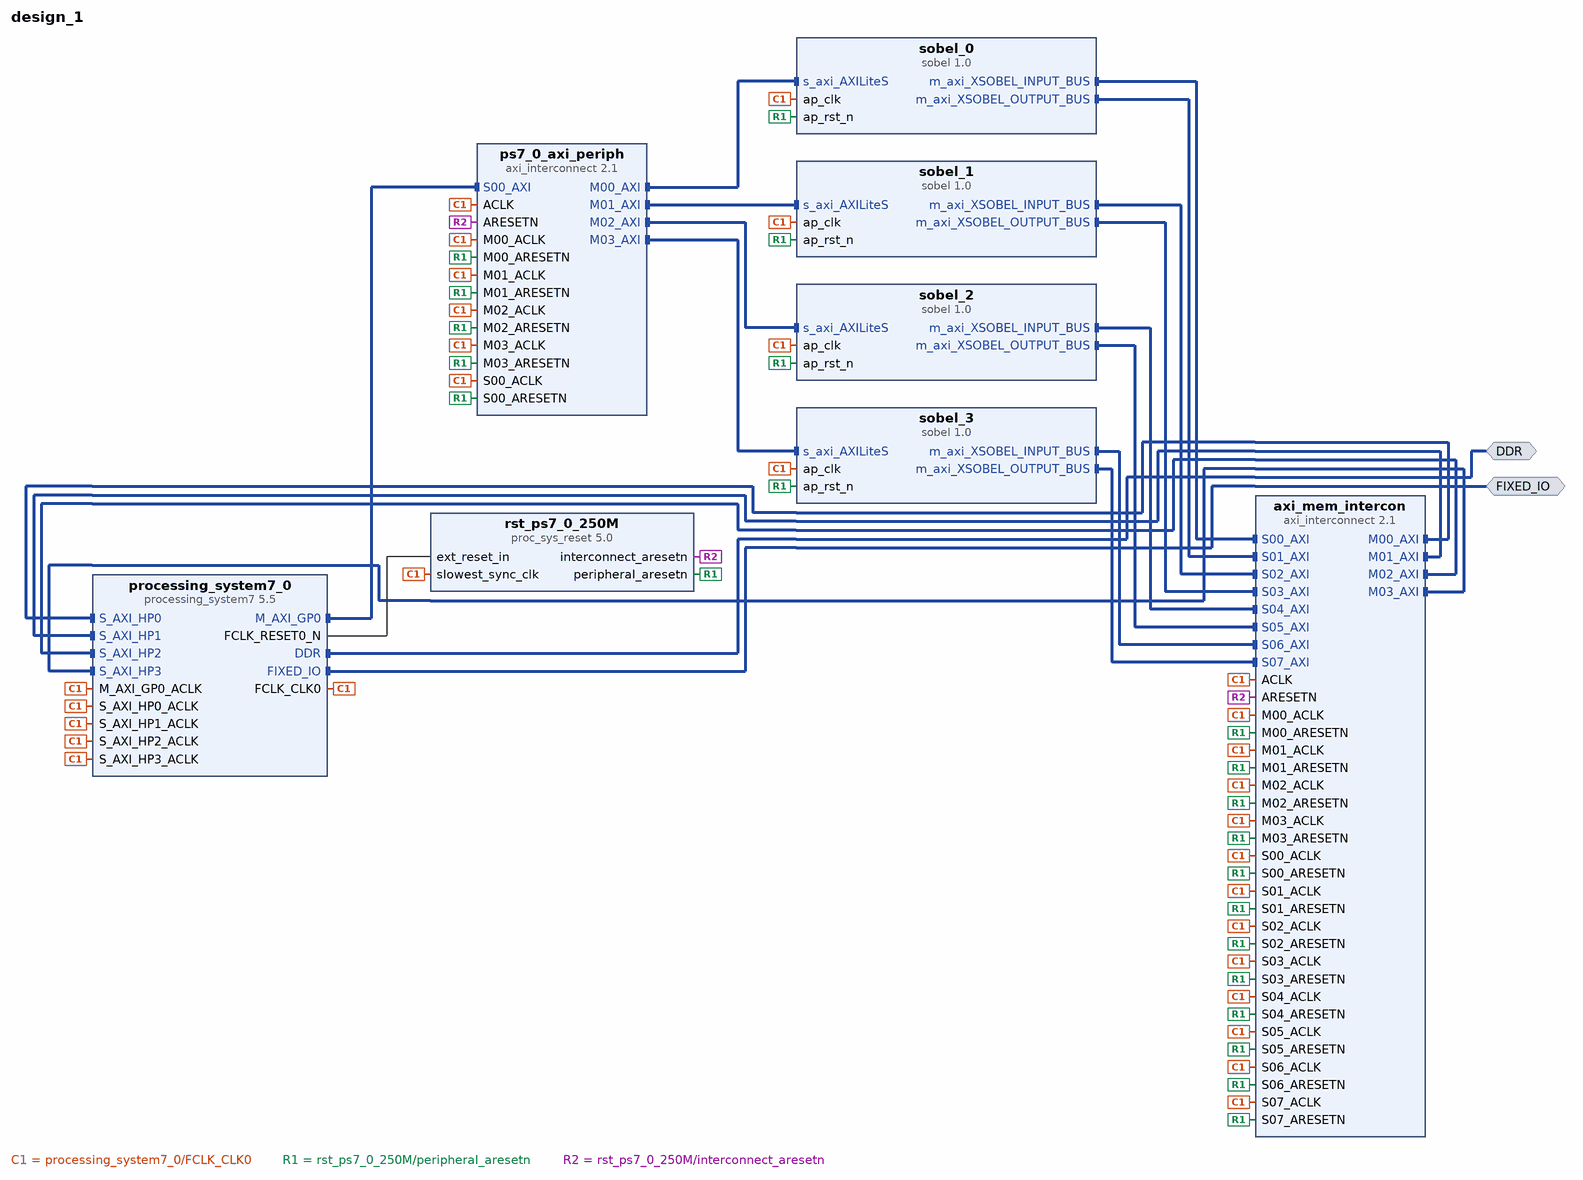
[diagram p0: block diagram of the top level]
# Vivado block design design_1, xc7z020clg484-1, Vivado 2016.4
create_bd_design design_1

create_bd_intf_port -mode Master -vlnv xilinx.com:interface:ddrx_rtl:1.0 DDR
create_bd_intf_port -mode Master -vlnv xilinx.com:display_processing_system7:fixedio_rtl:1.0 FIXED_IO

create_bd_cell -type ip -vlnv xilinx.com:ip:processing_system7:5.5 processing_system7_0
set_property -dict [list \
  CONFIG.PCW_FPGA0_PERIPHERAL_FREQMHZ 227 \
  CONFIG.PCW_USE_S_AXI_HP0 1 \
  CONFIG.PCW_USE_S_AXI_HP1 1 \
  CONFIG.PCW_USE_S_AXI_HP2 1 \
  CONFIG.PCW_USE_S_AXI_HP3 1 \
  CONFIG.PCW_QSPI_GRP_SINGLE_SS_ENABLE 1 \
  CONFIG.PCW_WDT_PERIPHERAL_ENABLE 1 \
  CONFIG.preset ZedBoard \
] [get_bd_cells processing_system7_0]
create_bd_cell -type ip -vlnv xilinx.com:ip:axi_interconnect:2.1 ps7_0_axi_periph
set_property -dict {CONFIG.NUM_MI 4} [get_bd_cells ps7_0_axi_periph]
create_bd_cell -type ip -vlnv xilinx.com:ip:proc_sys_reset:5.0 rst_ps7_0_250M
create_bd_cell -type ip -vlnv xilinx.com:ip:axi_interconnect:2.1 axi_mem_intercon
set_property -dict {CONFIG.NUM_SI 8 CONFIG.NUM_MI 4} [get_bd_cells axi_mem_intercon]
create_bd_cell -type ip -vlnv xilinx.com:hls:sobel:1.0 sobel_0
create_bd_cell -type ip -vlnv xilinx.com:hls:sobel:1.0 sobel_1
create_bd_cell -type ip -vlnv xilinx.com:hls:sobel:1.0 sobel_2
create_bd_cell -type ip -vlnv xilinx.com:hls:sobel:1.0 sobel_3

# ---- connections ----

connect_bd_intf_net [get_bd_intf_pins processing_system7_0/M_AXI_GP0] [get_bd_intf_pins ps7_0_axi_periph/S00_AXI]
connect_bd_intf_net [get_bd_intf_pins ps7_0_axi_periph/M00_AXI] [get_bd_intf_pins sobel_0/s_axi_AXILiteS]
connect_bd_intf_net [get_bd_intf_pins sobel_0/m_axi_XSOBEL_INPUT_BUS] [get_bd_intf_pins axi_mem_intercon/S00_AXI]
connect_bd_intf_net [get_bd_intf_pins axi_mem_intercon/M00_AXI] [get_bd_intf_pins processing_system7_0/S_AXI_HP0]
connect_bd_intf_net [get_bd_intf_pins sobel_0/m_axi_XSOBEL_OUTPUT_BUS] [get_bd_intf_pins axi_mem_intercon/S01_AXI]
connect_bd_intf_net [get_bd_intf_pins axi_mem_intercon/M01_AXI] [get_bd_intf_pins processing_system7_0/S_AXI_HP1]
connect_bd_intf_net [get_bd_intf_pins axi_mem_intercon/M02_AXI] [get_bd_intf_pins processing_system7_0/S_AXI_HP2]
connect_bd_intf_net [get_bd_intf_pins axi_mem_intercon/M03_AXI] [get_bd_intf_pins processing_system7_0/S_AXI_HP3]
connect_bd_intf_net [get_bd_intf_pins ps7_0_axi_periph/M01_AXI] [get_bd_intf_pins sobel_1/s_axi_AXILiteS]
connect_bd_intf_net [get_bd_intf_pins sobel_1/m_axi_XSOBEL_INPUT_BUS] [get_bd_intf_pins axi_mem_intercon/S02_AXI]
connect_bd_intf_net [get_bd_intf_pins sobel_1/m_axi_XSOBEL_OUTPUT_BUS] [get_bd_intf_pins axi_mem_intercon/S03_AXI]
connect_bd_intf_net [get_bd_intf_pins ps7_0_axi_periph/M02_AXI] [get_bd_intf_pins sobel_2/s_axi_AXILiteS]
connect_bd_intf_net [get_bd_intf_pins sobel_2/m_axi_XSOBEL_INPUT_BUS] [get_bd_intf_pins axi_mem_intercon/S04_AXI]
connect_bd_intf_net [get_bd_intf_pins sobel_2/m_axi_XSOBEL_OUTPUT_BUS] [get_bd_intf_pins axi_mem_intercon/S05_AXI]
connect_bd_intf_net [get_bd_intf_pins ps7_0_axi_periph/M03_AXI] [get_bd_intf_pins sobel_3/s_axi_AXILiteS]
connect_bd_intf_net [get_bd_intf_pins sobel_3/m_axi_XSOBEL_INPUT_BUS] [get_bd_intf_pins axi_mem_intercon/S06_AXI]
connect_bd_intf_net [get_bd_intf_pins sobel_3/m_axi_XSOBEL_OUTPUT_BUS] [get_bd_intf_pins axi_mem_intercon/S07_AXI]
connect_bd_intf_net [get_bd_intf_ports DDR] [get_bd_intf_pins processing_system7_0/DDR]
connect_bd_intf_net [get_bd_intf_ports FIXED_IO] [get_bd_intf_pins processing_system7_0/FIXED_IO]
connect_bd_net [get_bd_pins processing_system7_0/FCLK_CLK0] \
  [get_bd_pins processing_system7_0/M_AXI_GP0_ACLK] [get_bd_pins rst_ps7_0_250M/slowest_sync_clk] \
  [get_bd_pins processing_system7_0/S_AXI_HP0_ACLK] [get_bd_pins sobel_0/ap_clk] \
  [get_bd_pins processing_system7_0/S_AXI_HP1_ACLK] [get_bd_pins processing_system7_0/S_AXI_HP2_ACLK] \
  [get_bd_pins processing_system7_0/S_AXI_HP3_ACLK] [get_bd_pins sobel_1/ap_clk] [get_bd_pins sobel_2/ap_clk] \
  [get_bd_pins sobel_3/ap_clk] [get_bd_pins ps7_0_axi_periph/S00_ACLK] [get_bd_pins ps7_0_axi_periph/ACLK] \
  [get_bd_pins ps7_0_axi_periph/M00_ACLK] [get_bd_pins axi_mem_intercon/S00_ACLK] [get_bd_pins axi_mem_intercon/ACLK] \
  [get_bd_pins axi_mem_intercon/M00_ACLK] [get_bd_pins axi_mem_intercon/S01_ACLK] [get_bd_pins axi_mem_intercon/M01_ACLK] \
  [get_bd_pins axi_mem_intercon/M02_ACLK] [get_bd_pins axi_mem_intercon/M03_ACLK] [get_bd_pins ps7_0_axi_periph/M01_ACLK] \
  [get_bd_pins axi_mem_intercon/S02_ACLK] [get_bd_pins axi_mem_intercon/S03_ACLK] [get_bd_pins ps7_0_axi_periph/M02_ACLK] \
  [get_bd_pins axi_mem_intercon/S04_ACLK] [get_bd_pins axi_mem_intercon/S05_ACLK] [get_bd_pins ps7_0_axi_periph/M03_ACLK] \
  [get_bd_pins axi_mem_intercon/S06_ACLK] [get_bd_pins axi_mem_intercon/S07_ACLK]
connect_bd_net [get_bd_pins processing_system7_0/FCLK_RESET0_N] [get_bd_pins rst_ps7_0_250M/ext_reset_in]
connect_bd_net [get_bd_pins rst_ps7_0_250M/peripheral_aresetn] \
  [get_bd_pins sobel_0/ap_rst_n] [get_bd_pins sobel_1/ap_rst_n] [get_bd_pins sobel_2/ap_rst_n] [get_bd_pins sobel_3/ap_rst_n] \
  [get_bd_pins ps7_0_axi_periph/S00_ARESETN] [get_bd_pins ps7_0_axi_periph/M00_ARESETN] \
  [get_bd_pins axi_mem_intercon/S00_ARESETN] [get_bd_pins axi_mem_intercon/M00_ARESETN] \
  [get_bd_pins axi_mem_intercon/S01_ARESETN] [get_bd_pins axi_mem_intercon/M01_ARESETN] \
  [get_bd_pins axi_mem_intercon/M02_ARESETN] [get_bd_pins axi_mem_intercon/M03_ARESETN] \
  [get_bd_pins ps7_0_axi_periph/M01_ARESETN] [get_bd_pins axi_mem_intercon/S02_ARESETN] \
  [get_bd_pins axi_mem_intercon/S03_ARESETN] [get_bd_pins ps7_0_axi_periph/M02_ARESETN] \
  [get_bd_pins axi_mem_intercon/S04_ARESETN] [get_bd_pins axi_mem_intercon/S05_ARESETN] \
  [get_bd_pins ps7_0_axi_periph/M03_ARESETN] [get_bd_pins axi_mem_intercon/S06_ARESETN] \
  [get_bd_pins axi_mem_intercon/S07_ARESETN]
connect_bd_net [get_bd_pins rst_ps7_0_250M/interconnect_aresetn] [get_bd_pins ps7_0_axi_periph/ARESETN] [get_bd_pins axi_mem_intercon/ARESETN]

# ---- address map ----
assign_bd_address -offset 0x43C00000 -range 64K -target_address_space [get_bd_addr_spaces processing_system7_0/Data] [get_bd_addr_segs sobel_0/s_axi_AXILiteS/Reg]
assign_bd_address -offset 0x43C10000 -range 64K -target_address_space [get_bd_addr_spaces processing_system7_0/Data] [get_bd_addr_segs sobel_1/s_axi_AXILiteS/Reg]
assign_bd_address -offset 0x43C20000 -range 64K -target_address_space [get_bd_addr_spaces processing_system7_0/Data] [get_bd_addr_segs sobel_2/s_axi_AXILiteS/Reg]
assign_bd_address -offset 0x43C30000 -range 64K -target_address_space [get_bd_addr_spaces processing_system7_0/Data] [get_bd_addr_segs sobel_3/s_axi_AXILiteS/Reg]
assign_bd_address -offset 0x00000000 -range 64M -target_address_space [get_bd_addr_spaces sobel_0/Data_m_axi_XSOBEL_INPUT_BUS] [get_bd_addr_segs processing_system7_0/S_AXI_HP0/HP0_DDR_LOWOCM]
assign_bd_address -offset 0x04000000 -range 64M -target_address_space [get_bd_addr_spaces sobel_0/Data_m_axi_XSOBEL_INPUT_BUS] [get_bd_addr_segs processing_system7_0/S_AXI_HP1/HP1_DDR_LOWOCM]
assign_bd_address -offset 0x08000000 -range 64M -target_address_space [get_bd_addr_spaces sobel_0/Data_m_axi_XSOBEL_INPUT_BUS] [get_bd_addr_segs processing_system7_0/S_AXI_HP2/HP2_DDR_LOWOCM]
assign_bd_address -offset 0x0C000000 -range 64M -target_address_space [get_bd_addr_spaces sobel_0/Data_m_axi_XSOBEL_INPUT_BUS] [get_bd_addr_segs processing_system7_0/S_AXI_HP3/HP3_DDR_LOWOCM]
assign_bd_address -offset 0x00000000 -range 64M -target_address_space [get_bd_addr_spaces sobel_0/Data_m_axi_XSOBEL_OUTPUT_BUS] [get_bd_addr_segs processing_system7_0/S_AXI_HP0/HP0_DDR_LOWOCM]
assign_bd_address -offset 0x04000000 -range 64M -target_address_space [get_bd_addr_spaces sobel_0/Data_m_axi_XSOBEL_OUTPUT_BUS] [get_bd_addr_segs processing_system7_0/S_AXI_HP1/HP1_DDR_LOWOCM]
assign_bd_address -offset 0x08000000 -range 64M -target_address_space [get_bd_addr_spaces sobel_0/Data_m_axi_XSOBEL_OUTPUT_BUS] [get_bd_addr_segs processing_system7_0/S_AXI_HP2/HP2_DDR_LOWOCM]
assign_bd_address -offset 0x0C000000 -range 64M -target_address_space [get_bd_addr_spaces sobel_0/Data_m_axi_XSOBEL_OUTPUT_BUS] [get_bd_addr_segs processing_system7_0/S_AXI_HP3/HP3_DDR_LOWOCM]
assign_bd_address -offset 0x00000000 -range 64M -target_address_space [get_bd_addr_spaces sobel_1/Data_m_axi_XSOBEL_INPUT_BUS] [get_bd_addr_segs processing_system7_0/S_AXI_HP0/HP0_DDR_LOWOCM]
assign_bd_address -offset 0x04000000 -range 64M -target_address_space [get_bd_addr_spaces sobel_1/Data_m_axi_XSOBEL_INPUT_BUS] [get_bd_addr_segs processing_system7_0/S_AXI_HP1/HP1_DDR_LOWOCM]
assign_bd_address -offset 0x08000000 -range 64M -target_address_space [get_bd_addr_spaces sobel_1/Data_m_axi_XSOBEL_INPUT_BUS] [get_bd_addr_segs processing_system7_0/S_AXI_HP2/HP2_DDR_LOWOCM]
assign_bd_address -offset 0x0C000000 -range 64M -target_address_space [get_bd_addr_spaces sobel_1/Data_m_axi_XSOBEL_INPUT_BUS] [get_bd_addr_segs processing_system7_0/S_AXI_HP3/HP3_DDR_LOWOCM]
assign_bd_address -offset 0x00000000 -range 64M -target_address_space [get_bd_addr_spaces sobel_1/Data_m_axi_XSOBEL_OUTPUT_BUS] [get_bd_addr_segs processing_system7_0/S_AXI_HP0/HP0_DDR_LOWOCM]
assign_bd_address -offset 0x04000000 -range 64M -target_address_space [get_bd_addr_spaces sobel_1/Data_m_axi_XSOBEL_OUTPUT_BUS] [get_bd_addr_segs processing_system7_0/S_AXI_HP1/HP1_DDR_LOWOCM]
assign_bd_address -offset 0x08000000 -range 64M -target_address_space [get_bd_addr_spaces sobel_1/Data_m_axi_XSOBEL_OUTPUT_BUS] [get_bd_addr_segs processing_system7_0/S_AXI_HP2/HP2_DDR_LOWOCM]
assign_bd_address -offset 0x0C000000 -range 64M -target_address_space [get_bd_addr_spaces sobel_1/Data_m_axi_XSOBEL_OUTPUT_BUS] [get_bd_addr_segs processing_system7_0/S_AXI_HP3/HP3_DDR_LOWOCM]
assign_bd_address -offset 0x00000000 -range 64M -target_address_space [get_bd_addr_spaces sobel_2/Data_m_axi_XSOBEL_INPUT_BUS] [get_bd_addr_segs processing_system7_0/S_AXI_HP0/HP0_DDR_LOWOCM]
assign_bd_address -offset 0x04000000 -range 64M -target_address_space [get_bd_addr_spaces sobel_2/Data_m_axi_XSOBEL_INPUT_BUS] [get_bd_addr_segs processing_system7_0/S_AXI_HP1/HP1_DDR_LOWOCM]
assign_bd_address -offset 0x08000000 -range 64M -target_address_space [get_bd_addr_spaces sobel_2/Data_m_axi_XSOBEL_INPUT_BUS] [get_bd_addr_segs processing_system7_0/S_AXI_HP2/HP2_DDR_LOWOCM]
assign_bd_address -offset 0x0C000000 -range 64M -target_address_space [get_bd_addr_spaces sobel_2/Data_m_axi_XSOBEL_INPUT_BUS] [get_bd_addr_segs processing_system7_0/S_AXI_HP3/HP3_DDR_LOWOCM]
assign_bd_address -offset 0x00000000 -range 64M -target_address_space [get_bd_addr_spaces sobel_2/Data_m_axi_XSOBEL_OUTPUT_BUS] [get_bd_addr_segs processing_system7_0/S_AXI_HP0/HP0_DDR_LOWOCM]
assign_bd_address -offset 0x04000000 -range 64M -target_address_space [get_bd_addr_spaces sobel_2/Data_m_axi_XSOBEL_OUTPUT_BUS] [get_bd_addr_segs processing_system7_0/S_AXI_HP1/HP1_DDR_LOWOCM]
assign_bd_address -offset 0x08000000 -range 64M -target_address_space [get_bd_addr_spaces sobel_2/Data_m_axi_XSOBEL_OUTPUT_BUS] [get_bd_addr_segs processing_system7_0/S_AXI_HP2/HP2_DDR_LOWOCM]
assign_bd_address -offset 0x0C000000 -range 64M -target_address_space [get_bd_addr_spaces sobel_2/Data_m_axi_XSOBEL_OUTPUT_BUS] [get_bd_addr_segs processing_system7_0/S_AXI_HP3/HP3_DDR_LOWOCM]
assign_bd_address -offset 0x00000000 -range 64M -target_address_space [get_bd_addr_spaces sobel_3/Data_m_axi_XSOBEL_INPUT_BUS] [get_bd_addr_segs processing_system7_0/S_AXI_HP0/HP0_DDR_LOWOCM]
assign_bd_address -offset 0x04000000 -range 64M -target_address_space [get_bd_addr_spaces sobel_3/Data_m_axi_XSOBEL_INPUT_BUS] [get_bd_addr_segs processing_system7_0/S_AXI_HP1/HP1_DDR_LOWOCM]
assign_bd_address -offset 0x08000000 -range 64M -target_address_space [get_bd_addr_spaces sobel_3/Data_m_axi_XSOBEL_INPUT_BUS] [get_bd_addr_segs processing_system7_0/S_AXI_HP2/HP2_DDR_LOWOCM]
assign_bd_address -offset 0x0C000000 -range 64M -target_address_space [get_bd_addr_spaces sobel_3/Data_m_axi_XSOBEL_INPUT_BUS] [get_bd_addr_segs processing_system7_0/S_AXI_HP3/HP3_DDR_LOWOCM]
assign_bd_address -offset 0x00000000 -range 64M -target_address_space [get_bd_addr_spaces sobel_3/Data_m_axi_XSOBEL_OUTPUT_BUS] [get_bd_addr_segs processing_system7_0/S_AXI_HP0/HP0_DDR_LOWOCM]
assign_bd_address -offset 0x04000000 -range 64M -target_address_space [get_bd_addr_spaces sobel_3/Data_m_axi_XSOBEL_OUTPUT_BUS] [get_bd_addr_segs processing_system7_0/S_AXI_HP1/HP1_DDR_LOWOCM]
assign_bd_address -offset 0x08000000 -range 64M -target_address_space [get_bd_addr_spaces sobel_3/Data_m_axi_XSOBEL_OUTPUT_BUS] [get_bd_addr_segs processing_system7_0/S_AXI_HP2/HP2_DDR_LOWOCM]
assign_bd_address -offset 0x0C000000 -range 64M -target_address_space [get_bd_addr_spaces sobel_3/Data_m_axi_XSOBEL_OUTPUT_BUS] [get_bd_addr_segs processing_system7_0/S_AXI_HP3/HP3_DDR_LOWOCM]

validate_bd_design
save_bd_design
